# EasyEDA Pro project ProDocument_lpc-glitcherv2_2024-04-16.epro

# Schematic lpc-glitcherv2
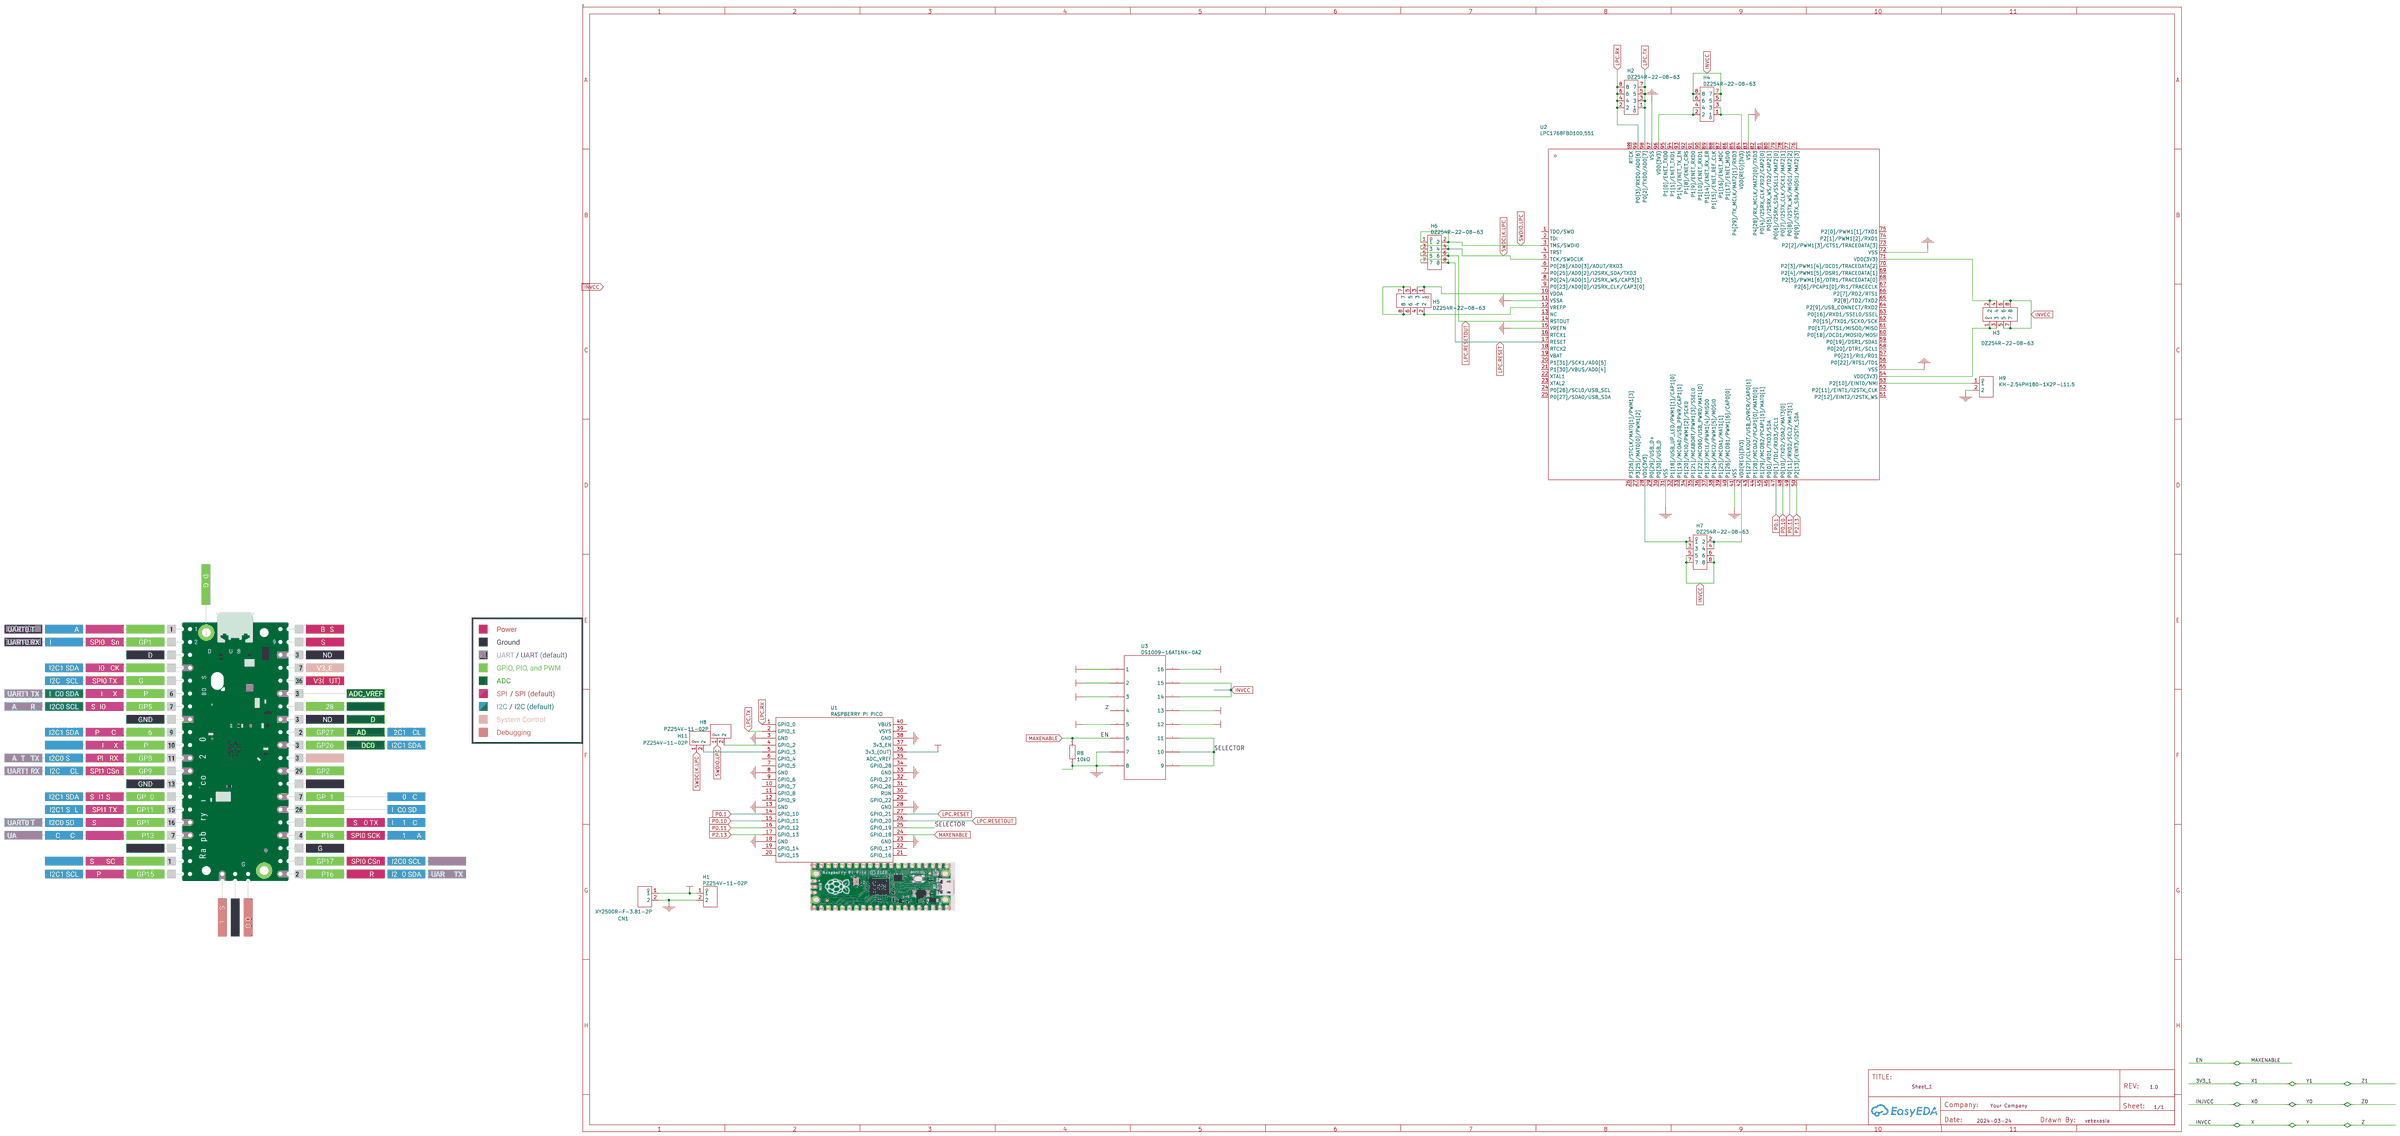
[diagram p0: schematic sheet]

## Parts
CN1  XY2500R-F-3.81-2P  [footprint_3c6d]
H1  PZ254V-11-02P  [footprint_e48f]
H2  DZ254R-22-08-63  [footprint_0830]
H3  DZ254R-22-08-63  [footprint_0830]
H4  DZ254R-22-08-63  [footprint_0830]
H5  DZ254R-22-08-63  [footprint_0830]
H6  DZ254R-22-08-63  [footprint_0830]
H7  DZ254R-22-08-63  [footprint_0830]
H8  PZ254V-11-02P  [footprint_e48f]
H9  KH-2.54PH180-1X2P-L11.5  [footprint_e48f]
H11  PZ254V-11-02P  [footprint_e48f]
R8  10kΩ  [footprint_fe1b]
U1  RASPBERRY PI PICO  [footprint_dab4]
U2  LPC1768FBD100,551  [footprint_b10c]
U3  DS1009-16AT1NX-0A2  [footprint_764f]

## Library data of the parts
CN1 = XY2500R-F-3.81-2P: Supplier: LCSC; Supplier Part: C880581; Manufacturer: XINLAIYA(新莱亚); JLCPCB Part Class: Extended Part
H1 H8 H11 = PZ254V-11-02P: Supplier: LCSC; Supplier Part: C492401; Manufacturer: XFCN(兴飞); JLCPCB Part Class: Extended Part
H2-H7 = DZ254R-22-08-63: Supplier: LCSC; Supplier Part: C2935919; Manufacturer: DEALON(德艺隆); JLCPCB Part Class: Extended Part
H9 = KH-2.54PH180-1X2P-L11.5: Supplier: LCSC; Supplier Part: C2905434; Manufacturer: kinghelm(金航标); JLCPCB Part Class: Extended Part
R8 = 10kΩ: Supplier: LCSC; Manufacturer: YAGEO(国巨); Manufacturer Part: RC0603FR-0710KL; Supplier Part: C98220; JLCPCB Part Class: Extended Part; link: https://lcsc.com/eda_search?q=C98220&amp;%26type=1&amp;ref=editor
U1 = RASPBERRY PI PICO
U2 = LPC1768FBD100,551: Supplier: LCSC; Manufacturer: NXP(恩智浦); Supplier Part: C9875; JLCPCB Part Class: Extended Part
U3 = DS1009-16AT1NX-0A2: Supplier: LCSC; Manufacturer: CONNFLY; Supplier Part: C72115; JLCPCB Part Class: Extended Part

## Nets
3V3_1: U1.36(3v3 (OUT)) U3.1 U3.3 U3.13 U3.16
GND: CN1.2 H1.2 H9.2 R8.1 U1.3(GND) U1.8(GND) U1.13(GND) U1.18(GND) U1.23(GND) U1.28(GND) U1.33(GND) U1.38(GND) U2.11(VSSA) U2.15(VREFN) U2.31(VSS) U2.41(VSS) U2.55(VSS) U2.72(VSS) U2.83(VSS) U2.97(VSS) U3.7 U3.8
EN: R8.2 U1.24(GPIO 18) U3.6
INJVCC: CN1.1 H1.1 U3.2 U3.5 U3.12
INVCC: H3.5 H3.6 H3.7 H3.8 H4.5 H4.6 H4.7 H4.8 H7.5 H7.6 H7.7 H7.8 U3.4 U3.14 U3.15
LPC.RESET: H6.7 H6.8 U1.27(GPIO 21) U2.17(RESET)
LPC.RESETOUT: H6.5 H6.6 U1.26(GPIO 20) U2.14(RSTOUT)
LPC.RX: H2.2 H2.4 H2.6 H2.8 U1.1(GPIO 0) U2.99(P0[3]/RXD0/AD0[6])
LPC.TX: H2.1 H2.3 H2.5 H2.7 U1.2(GPIO 1) U2.98(P0[2]/TXD0/AD0[7])
P0.1: U1.14(GPIO 10) U2.47(P0[1]/TD1/RXD3/SCL1)
P0.10: U1.15(GPIO 11) U2.48(P0[10]/TXD2/SDA2/MAT3[0])
P0.11: U1.16(GPIO 12) U2.49(P0[11]/RXD2/SCL2/MAT3[1])
P2.13: U1.17(GPIO 13) U2.50(P2[13]/EINT3/I2STX_SDA)
SELECTOR: U1.25(GPIO 19) U3.9 U3.10 U3.11
SWDCLK.LPC: H6.3 H6.4 H11.1 U2.5(TCK/SWDCLK)
SWDIO.LPC: H6.1 H6.2 H8.1 U2.3(TMS/SWDIO)
H3_1: H3.1 H3.3 U2.54(VDD(3V3))
H3_4: H3.2 H3.4 U2.71(VDD(3V3))
H4_1: H4.1 H4.3 U2.84(VDD(REG)(3V3))
H4_4: H4.2 H4.4 U2.96(VDD(3V3))
H5_1: H5.1 H5.3 U2.10(VDDA)
H5_4: H5.2 H5.4 U2.12(VREFP)
H7_1: H7.1 H7.3 U2.28(VDD(3V3))
H7_4: H7.2 H7.4 U2.42(VDD(REG)(3V3))
Net-(H5-5): H5.5 H5.6 H5.7 H5.8
Net-(H9-1): H9.1 U2.53(P2[10]/EINT0/NMI)
U1_4: H8.2 U1.4(GPIO 2)
U1_5: H11.2 U1.5(GPIO 3)

Not connected (* = marked no-connect by the designer): U1 6(GPIO 4) 7(GPIO 5) 9(GPIO 6) 10(GPIO 7) 11(GPIO 8) 12(GPIO 9) 19(GPIO 14) 20(GPIO 15) 21(GPIO 16) 22(GPIO 17) 29(GPIO 22) 30(RUN) 31(GPIO 26) 32(GPIO 27) 34(GPIO 28) 35(ADC_VREF) 37(3v3_EN) 39(VSYS) 40(VBUS); U2 1(TDO/SWO) 2(TDI) 4(TRST) 6(P0[26]/AD0[3]/AOUT/RXD3) 7(P0[25]/AD0[2]/I2SRX_SDA/TXD3) 8(P0[24]/AD0[1]/I2SRX_WS/CAP3[1]) 9(P0[23]/AD0[0]/I2SRX_CLK/CAP3[0]) 13(NC) 16(RTCX1) 18(RTCX2) 19(VBAT) 20(P1[31]/SCK1/AD0[5]) 21(P1[30]/VBUS/AD0[4]) 22(XTAL1) 23(XTAL2) 24(P0[28]/SCL0/USB_SCL) 25(P0[27]/SDA0/USB_SDA) 26(P3[26]/STCLK/MAT0[1]/PWM1[3]) 27(P3[25]/MAT0[0]/PWM1[2]) 29(P0[29]/USB_D+) 30(P0[30]/USB_D) 32(P1[18]/USB_UP_LED/PWM1[1]/CAP1[0]) 33(P1[19]/MCOA0/USB_PPWR/CAP1[1]) 34(P1[20]/MCI0/PWM1[2]/SCK0) 35(P1[21]/MCABORT/PWM1[3]/SSEL0) 36(P1[22]/MCOB0/USB_PWRD/MAT1[0]) 37(P1[23]/MCI1/PWM1[4]/MISO0) 38(P1[24]/MCI2/PWM1[5]/MOSI0) 39(P1[25]/MCOA1/MAT1[1]) 40(P1[26]/MCOB1/PWM1[6]/CAP0[0]) 43(P1[27]/CLKOUT/USB_OVRCR/CAP0[1]) 44(P1[28]/MCOA2/PCAP1[0]/MAT0[0]) 45(P1[29]/MCOB2/PCAP1[1]/MAT0[1]) 46(P0[0]/RD1/TXD3/SDA) 51(P2[12]/EINT2/I2STX_WS) 52(P2[11]/EINT1/I2STX_CLK) 56(P0[22]/RTS1/TD1) 57(P0[21]/RI1/RD1) 58(P0[20]/DTR1/SCL1) 59(P0[19]/DSR1/SDA1) 60(P0[18]/DCD1/MOSI0/MOSI) 61(P0[17]/CTS1/MISO0/MISO) 62(P0[15]/TXD1/SCK0/SCK) 63(P0[16]/RXD1/SSEL0/SSEL) 64(P2[9]/USB_CONNECT/RXD2) 65(P2[8]/TD2/TXD2) 66(P2[7]/RD2/RTS1) 67(P2[6]/PCAP1[0]/RI1/TRACECLK) 68(P2[5]/PWM1[6]/DTR1/TRACEDATA[0]) 69(P2[4]/PWM1[5]/DSR1/TRACEDATA[1]) 70(P2[3]/PWM1[4]/DCD1/TRACEDATA[2]) 73(P2[2]/PWM1[3]/CTS1/TRACEDATA[3]) 74(P2[1]/PWM1[2]/RXD1) 75(P2[0]/PWM1[1]/TXD1) 76(P0[9]/I2STX_SDA/MOSI1/MAT2[3]) 77(P0[8]/I2STX_WS/MISO1/MAT2[2]) 78(P0[7]/I2STX_CLK/SCK1/MAT2[1]) 79(P0[6]/I2SRX_SDA/SSEL1/MAT2[0]) 80(P0[5]/I2SRX_WS/TD2/CAP2[1]) 81(P0[4]/I2SRX_CLK/RD2/CAP2[0]) 82(P4[28]/RX_MCLK/MAT2[0]/TXD3) 85(P4[29]/TX_MCLK/MAT2[1]/RXD3) 86(P1[17]/ENET_MDIO) 87(P1[16]/ENET_MDC) 88(P1[15]/ENET_REF_CLK) 89(P1[14]/ENET_RX_ER) 90(P1[10]/ENET_RXD1) 91(P1[9]/ENET_RXD0) 92(P1[8]/ENET_CRS) 93(P1[4]/ENET_TX_EN) 94(P1[1]/ENET_TXD1) 95(P1[0]/ENET_TXD0) 100(RTCK)

# Board 1-PCB_PCB_lpc-glitcherv2_2
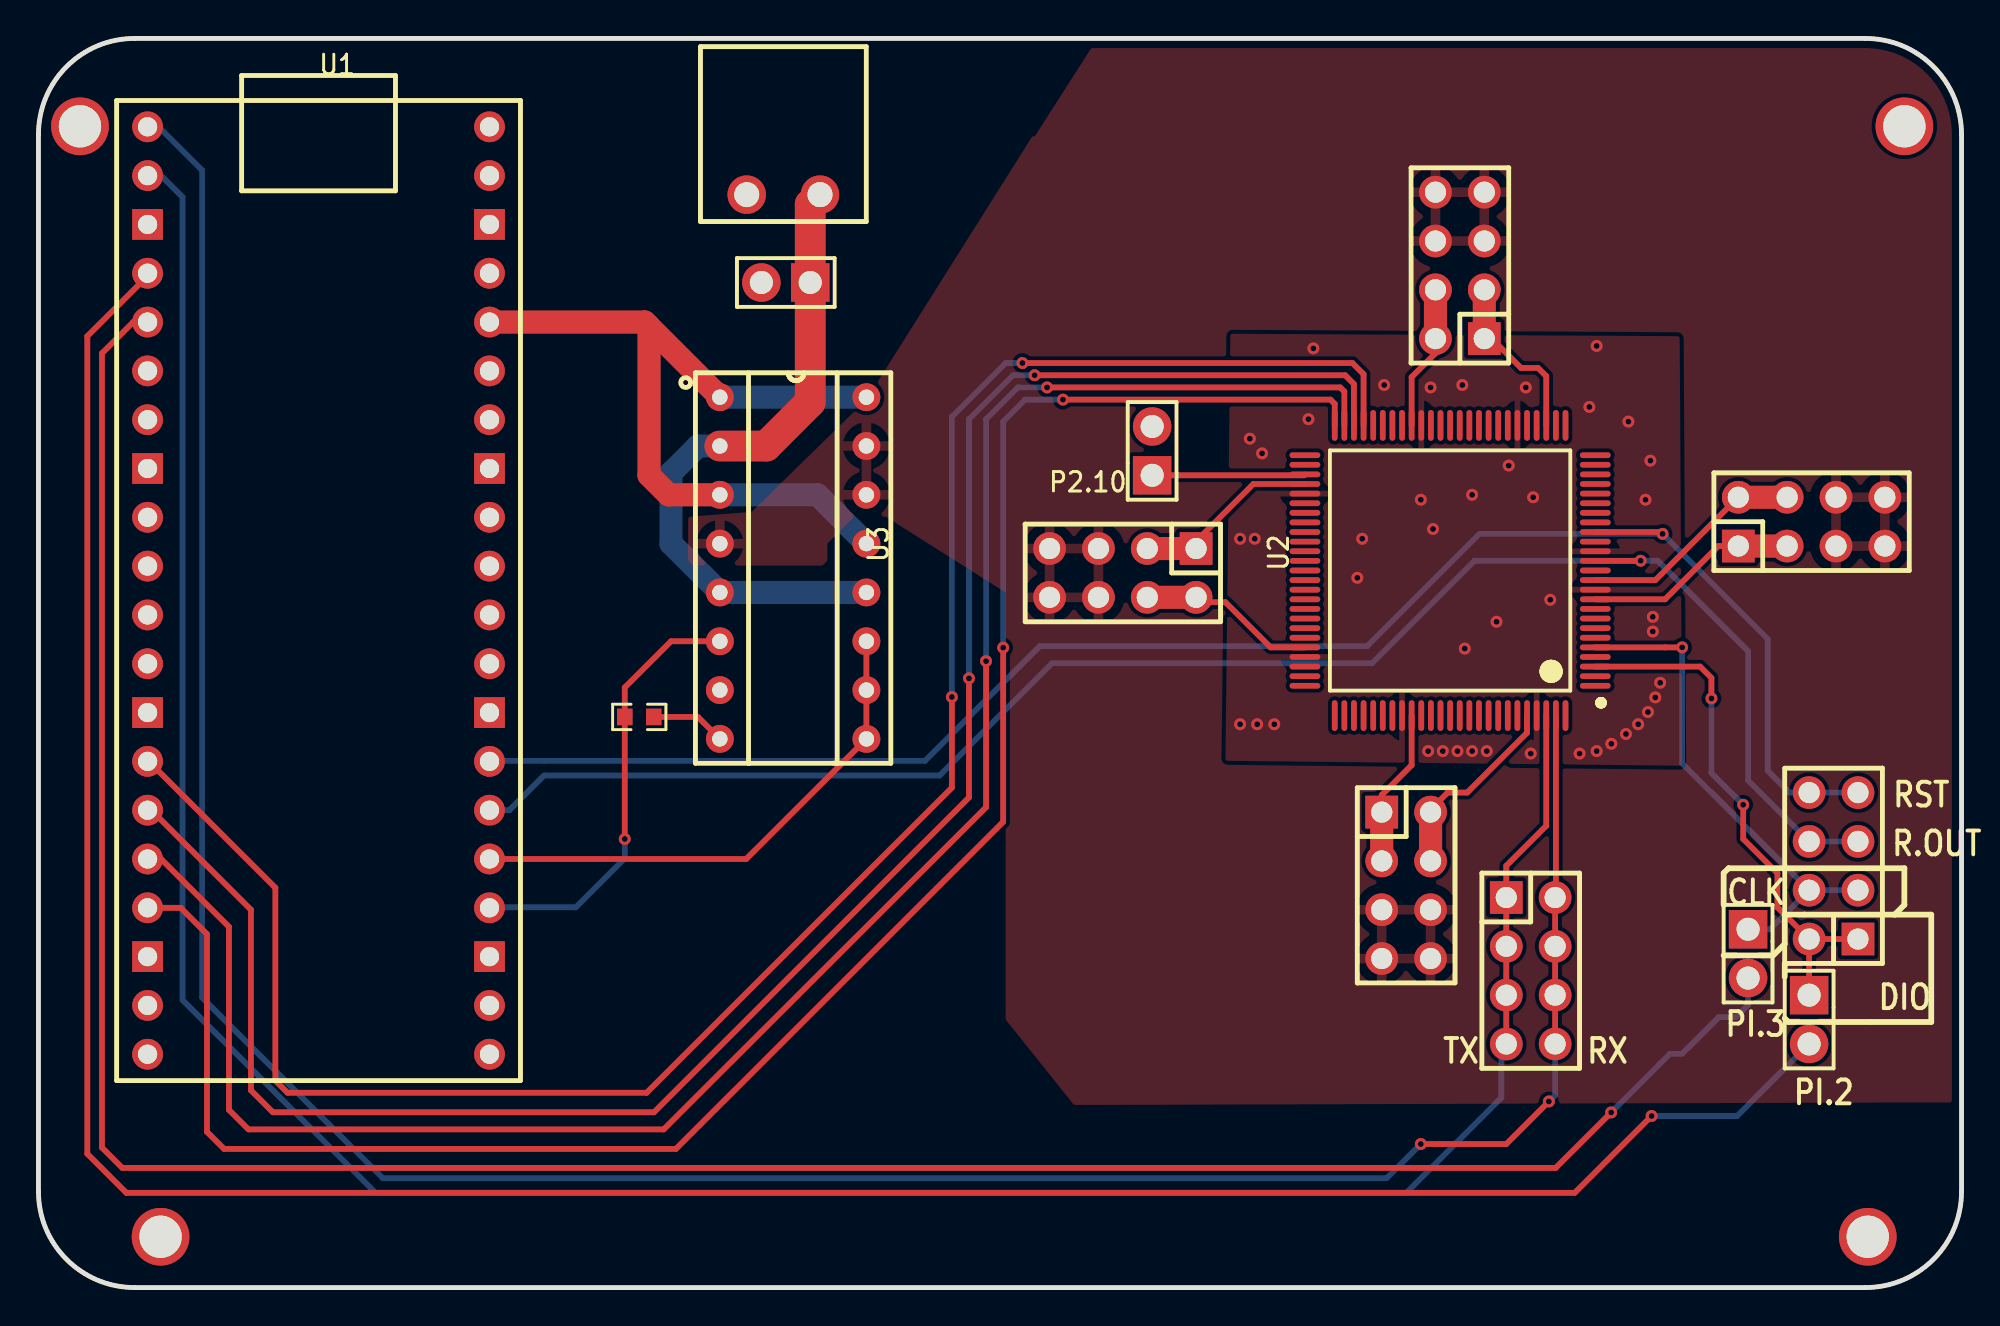
[diagram p1: board, top side]
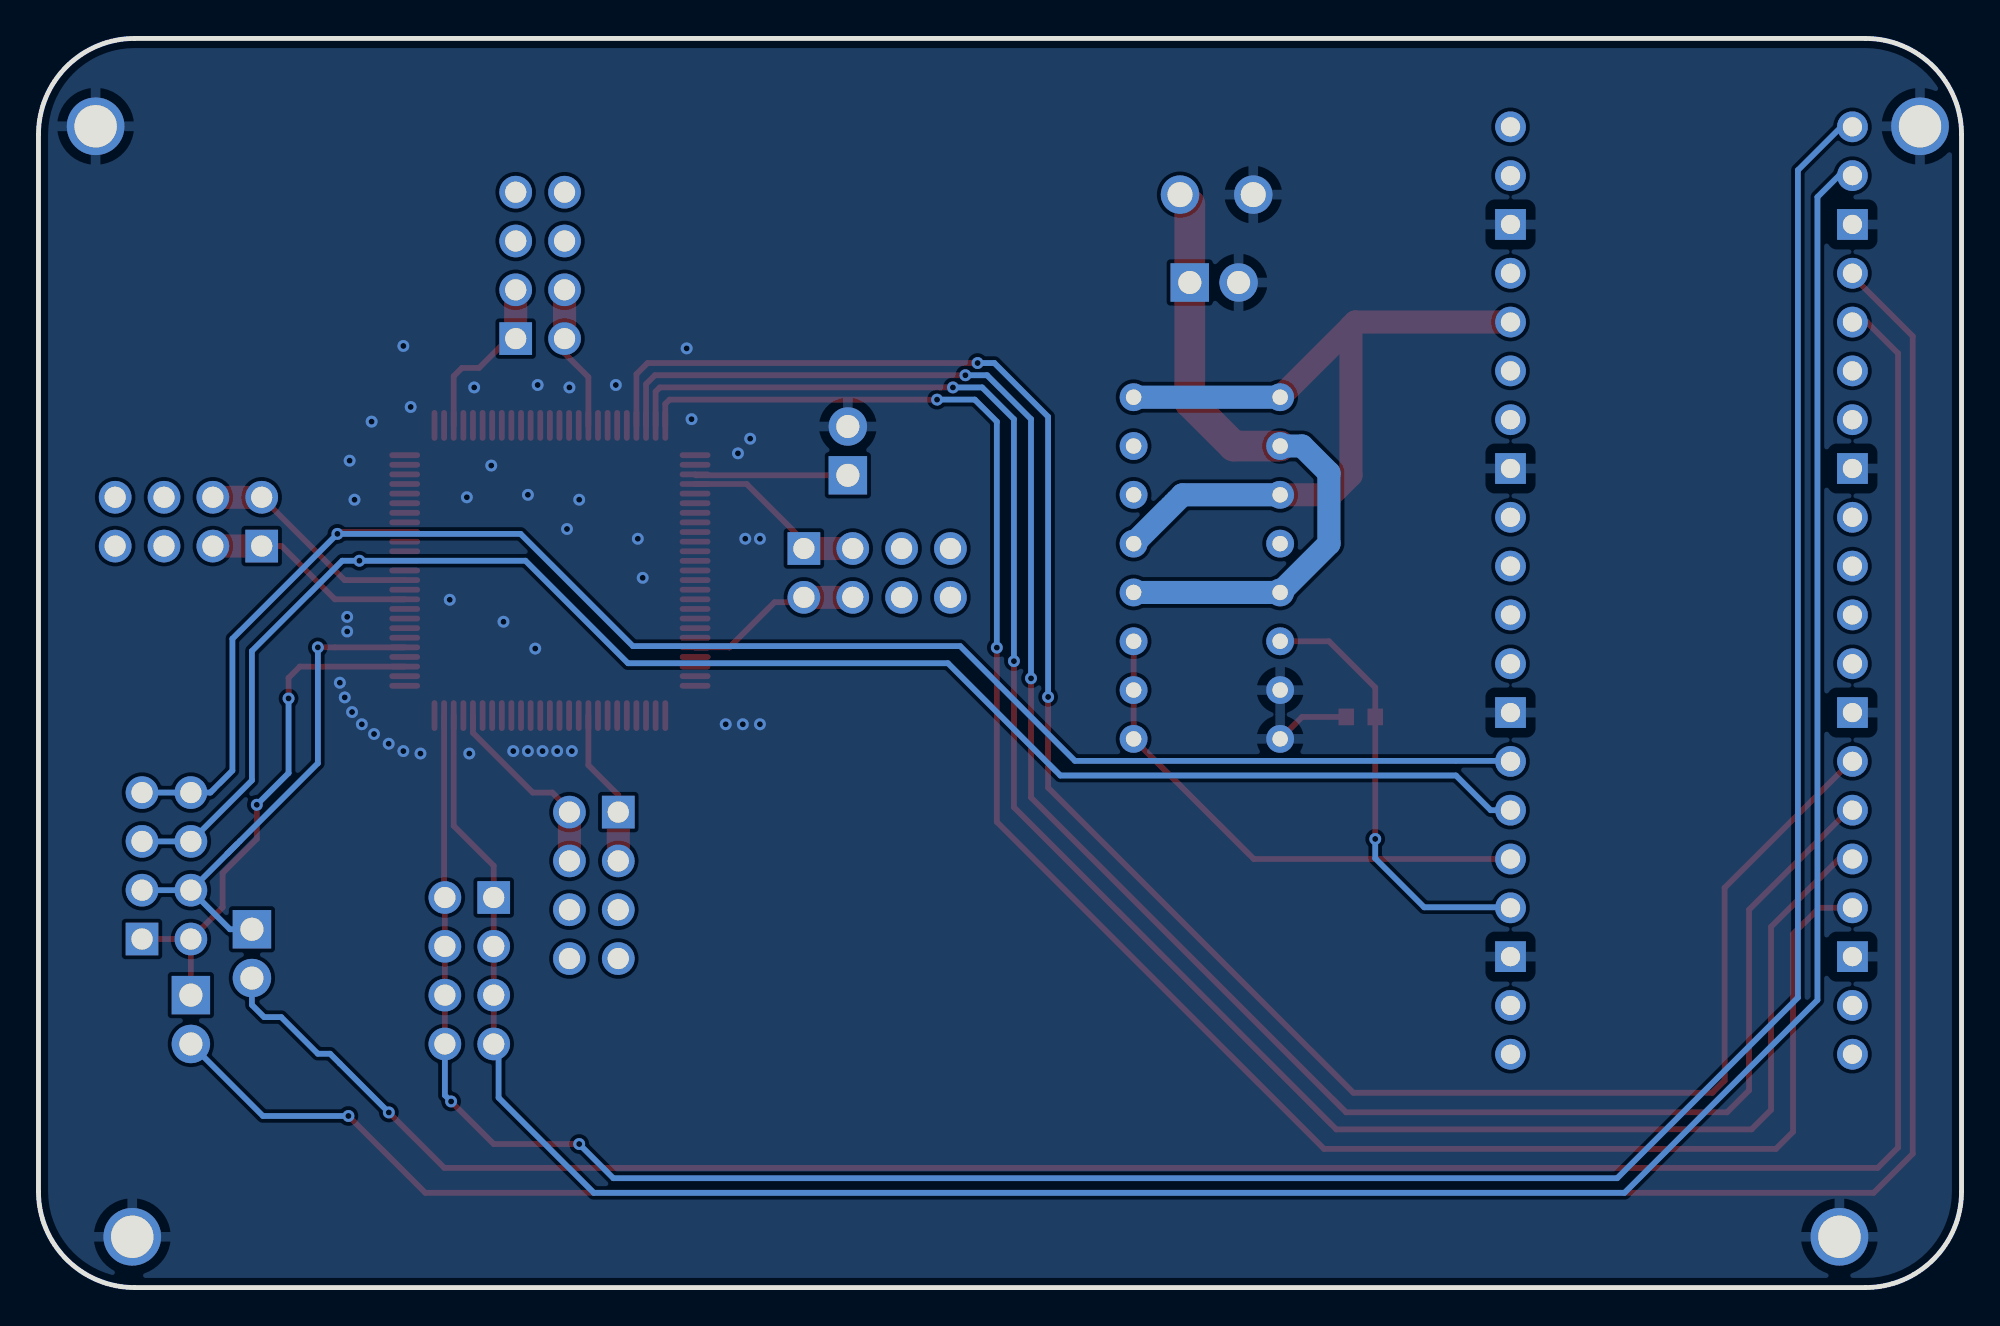
[diagram p2: board, bottom side, seen from below]

Outline 100 x 65 mm; copper layers: Top Layer, Bottom Layer. Coordinates in mm from the lower left corner of the outline.
Outline path: 0,60 arc(1.46,63.54) 5,65 95,65 arc(98.54,63.54) 100,60 100,5 arc(98.54,1.46) 95,0 5,0 arc(1.46,1.46) 0,5 0,60
Stack: Top Layer 0.035mm / Dielectric1 1.51mm FR4 er 4.5 / Bottom Layer 0.035mm

## Design rules (mm)
spacing Default (default): track to track 0.152, other pairs 0 to 0.152
track width Default (default): min 0.254, default 0.254, max 25.4
differential pair differentialPair (default): width min 0.127, default 0.254, max 2.54; gap min 0.152, default 0.152
via Default (default): diameter min 0.61, default 0.61, max 100.025; hole min 0.305, default 0.305, max 59.995
net GND uses gge7207
net Y uses gge7291
pour e84 uses gge7387
pour e224 uses gge7207
pour e225 uses gge7291

## Placement (name value [footprint] x y rotation side)
CN1  XY2500R-F-3.81-2P  [footprint_3c6d]  38.74 56.87 180 top
H1  PZ254V-11-02P  [footprint_e48f]  38.86 52.3 180 top
H2  DZ254R-22-08-63  [footprint_0830]  77.6 16.49 270 top
H3  DZ254R-22-08-63  [footprint_0830]  56.39 37.19 180 top
H4  DZ254R-22-08-63  [footprint_0830]  71.12 20.93 270 top
H5  DZ254R-22-08-63  [footprint_0830]  92.2 39.85 0 top
H6  DZ254R-22-08-63  [footprint_0830]  93.34 21.95 90 top
H7  DZ254R-22-08-63  [footprint_0830]  73.91 53.19 90 top
H8  PZ254V-11-02P  [footprint_e48f]  92.07 13.95 270 top
H11  PZ254V-11-02P  [footprint_e48f]  88.9 17.38 270 top
NOREF  -  [Pad_e504]  2.16 60.43 180 top
NOREF#2  -  [Pad_e507]  6.35 2.64 180 top
NOREF#3  -  [Pad_e506]  95.12 2.64 180 top
NOREF#4  -  [Pad_e505]  97.03 60.43 180 top
P2.10  KH-2.54PH180-1X2P-L11.5  [footprint_e48f]  57.91 43.54 90 top
R8  10kΩ  [footprint_fe1b]  31.24 29.69 180 top
U1  RASPBERRY PI PICO  [footprint_dab4]  4.06 10.77 0 top
U2  LPC1768FBD100,551  [footprint_b10c]  73.41 37.31 90 top
U3  DS1009-16AT1NX-0A2  [footprint_764f]  39.24 37.44 270 top

## Footprints (pads in the part's own frame, mm; a bottom-side part is the same pattern mirrored in y, then rotated)
footprint_3c6d
  round 2 hole 1.3: 1(-1.905,0) 2(1.905,0)
footprint_764f
  round 1.45 hole 0.8: 1(-8.89,-3.81) 2(-6.35,-3.81) 3(-3.81,-3.81) 4(-1.27,-3.81) 5(1.27,-3.81) 6(3.81,-3.81) 7(6.35,-3.81) 8(8.89,-3.81) 9(8.89,3.81) 10(6.35,3.81) 11(3.81,3.81) 12(1.27,3.81) 13(-1.27,3.81) 14(-3.81,3.81) 15(-6.35,3.81) 16(-8.89,3.81)
footprint_0830
  rect 1.7x1.7 hole 1.1: 1(-3.81,-1.27)
  round 1.7 hole 1.1: 2(-3.81,1.27) 3(-1.27,-1.27) 4(-1.27,1.27) 5(1.27,-1.27) 6(1.27,1.27) 7(3.81,-1.27) 8(3.81,1.27)
footprint_b10c
  oval 0.3x1.6 smd: 1(-6,-7.55) 2(-5.5,-7.55) 3(-5,-7.55) 4(-4.5,-7.55) 5(-4,-7.55) 6(-3.5,-7.55) 7(-3,-7.55) 8(-2.5,-7.55) 9(-2,-7.55) 10(-1.5,-7.55) 11(-1,-7.55) 12(-0.5,-7.55) 13(0,-7.55) 14(0.5,-7.55) 15(1,-7.55) 16(1.5,-7.55) 17(2,-7.55) 18(2.5,-7.55) 19(3,-7.55) 20(3.5,-7.55) 21(4,-7.55) 22(4.5,-7.55) 23(5,-7.55) 24(5.5,-7.55) 25(6,-7.55) 51(6,7.55) 52(5.5,7.55) 53(5,7.55) 54(4.5,7.55) 55(4,7.55) 56(3.5,7.55) 57(3,7.55) 58(2.5,7.55) 59(2,7.55) 60(1.5,7.55) 61(1,7.55) 62(0.5,7.55) 63(0,7.55) 64(-0.5,7.55) 65(-1,7.55) 66(-1.5,7.55) 67(-2,7.55) 68(-2.5,7.55) 69(-3,7.55) 70(-3.5,7.55) 71(-4,7.55) 72(-4.5,7.55) 73(-5,7.55) 74(-5.5,7.55) 75(-6,7.55)
  oval 1.6x0.3 smd: 26(7.55,-6) 27(7.55,-5.5) 28(7.55,-5) 29(7.55,-4.5) 30(7.55,-4) 31(7.55,-3.5) 32(7.55,-3) 33(7.55,-2.5) 34(7.55,-2) 35(7.55,-1.5) 36(7.55,-1) 37(7.55,-0.5) 38(7.55,0) 39(7.55,0.5) 40(7.55,1) 41(7.55,1.5) 42(7.55,2) 43(7.55,2.5) 44(7.55,3) 45(7.55,3.5) 46(7.55,4) 47(7.55,4.5) 48(7.55,5) 49(7.55,5.5) 50(7.55,6) 76(-7.55,6) 77(-7.55,5.5) 78(-7.55,5) 79(-7.55,4.5) 80(-7.55,4) 81(-7.55,3.5) 82(-7.55,3) 83(-7.55,2.5) 84(-7.55,2) 85(-7.55,1.5) 86(-7.55,1) 87(-7.55,0.5) 88(-7.55,0) 89(-7.55,-0.5) 90(-7.55,-1) 91(-7.55,-1.5) 92(-7.55,-2) 93(-7.55,-2.5) 94(-7.55,-3) 95(-7.55,-3.5) 96(-7.55,-4) 97(-7.55,-4.5) 98(-7.55,-5) 99(-7.55,-5.5) 100(-7.55,-6)
footprint_dab4
  round 1.6 hole 1: 1(1.61,49.63) 2(1.61,47.09) 4(1.61,42.01) 5(1.61,39.47) 6(1.61,36.93) 7(1.61,34.39) 9(1.61,29.31) 10(1.61,26.77) 11(1.61,24.23) 12(1.61,21.69) 14(1.61,16.61) 15(1.61,14.07) 16(1.61,11.53) 17(1.61,8.99) 19(1.61,3.91) 20(1.61,1.37) 21(19.39,1.37) 22(19.39,3.91) 24(19.39,8.99) 25(19.39,11.53) 26(19.39,14.07) 27(19.39,16.61) 29(19.39,21.69) 30(19.39,24.23) 31(19.39,26.77) 32(19.39,29.31) 34(19.39,34.39) 35(19.39,36.93) 36(19.39,39.47) 37(19.39,42.01) 39(19.39,47.09) 40(19.39,49.63)
  rect 1.6x1.6 hole 1: 3(1.61,44.55) 8(1.61,31.85) 13(1.61,19.15) 18(1.61,6.45) 23(19.39,6.45) 28(19.39,19.15) 33(19.39,31.85) 38(19.39,44.55)
footprint_e48f
  rect 2x2 hole 1.2: 1(-1.27,0)
  round 2 hole 1.2: 2(1.27,0)
footprint_fe1b
  rect 0.806x0.864 smd: 1(-0.753,0) 2(0.753,0)
Pad_e504
  round 3 hole 2.2: 1(0,0)
Pad_e505
  round 3 hole 2.2: 1(0,0)
Pad_e506
  round 3 hole 2.2: 1(0,0)
Pad_e507
  round 3 hole 2.2: 1(0,0)

## Nets
As in the schematic, except:
GND: CN1.2 H1.2 NOREF.1 NOREF#2.1 NOREF#3.1 NOREF#4.1 P2.10.2 R8.1 U1.3 U1.8 U1.13 U1.18 U1.23 U1.28 U1.33 U1.38 U2.11 U2.15 U2.31 U2.41 U2.55 U2.72 U2.83 U2.97 U3.7 U3.8
H9_1: P2.10.1 U2.53
Y: H3.5 H3.6 H3.7 H3.8 H4.5 H4.6 H4.7 H4.8 H5.5 H5.6 H5.7 H5.8 H7.5 H7.6 H7.7 H7.8 U3.4 U3.14 U3.15

## Via types
v1: diameter 0.62, hole 0.31, Top Layer to Bottom Layer, 62 vias

## Routing (per net, layer and track width the routed paths; a pad name or vN(x,y) marks a point on that pad's centre or on a via; arc(x,y) is an arc through that point)
3V3_1: length 42.1
  Top Layer w1.2: 31.52,50.24 U3.1 ; 31.52,50.24 U1.36 ; 31.52,50.24 31.75,50.01 31.75,42.27 32.77,41.25 U3.3
  Bottom Layer w1.2: U3.3 40.51,41.25 U3.13 ; U3.16 U3.1
GND: length 3.9
  Top Layer w0.3: R8.1 34.29,29.69 U3.8
  vias: v1(62.48,38.97) v1(62.48,29.31) v1(62.99,44.17) v1(63.25,38.97) v1(63.37,29.31) v1(63.63,43.41) v1(64.26,29.31) v1(66.04,45.19) v1(66.29,48.87) v1(68.58,36.93) v1(68.83,38.97) v1(69.98,46.97) v1(71.88,41) v1(72.26,27.92) v1(72.39,46.84) v1(72.52,39.47) v1(73.03,27.92) v1(73.79,27.92) v1(74.04,46.97) v1(74.17,33.25) v1(74.55,41.25) v1(74.55,27.92) v1(75.31,27.92) v1(75.82,34.65) v1(76.45,42.78) v1(77.34,46.84) v1(77.6,27.79) v1(77.72,41.12) v1(78.61,35.79) v1(80.14,27.79) v1(80.65,45.82) v1(81.03,49) v1(81.03,27.92) v1(81.79,28.3) v1(82.55,28.81) v1(82.68,45.06) v1(83.19,29.31) v1(83.57,41) v1(83.69,29.95) v1(83.82,43.03) v1(83.95,34.9) v1(83.95,34.14) v1(84.07,30.71) v1(84.33,31.47)
EN: length 22.9
  Top Layer w0.3: v1(30.49,23.34) R8.2 30.49,31.23 32.89,33.63 U3.6
  Bottom Layer w0.3: v1(30.49,23.34) 30.49,22.34 27.94,19.79 23.48,19.79 U1.24
H3_1: length 9.8
  Top Layer w0.3: H3.1 60.2,38.84 63.17,41.81 U2.54
  Top Layer w1.2: H3.3 H3.1
H3_4: length 9.3
  Top Layer w0.3: U2.71 64.07,33.31 61.72,35.66 60.45,35.66 H3.2
  Top Layer w1.2: H3.2 H3.4
H4_1: length 8.2
  Top Layer w0.3: H4.1 69.85,25.63 71.41,27.19 U2.84
  Top Layer w1.2: H4.1 H4.3
H4_4: length 10.2
  Top Layer w0.3: U2.96 77.41,28.87 74.29,25.76 73.28,25.76 72.39,24.87 H4.2
  Top Layer w1.2: H4.2 H4.4
H5_1: length 11.1
  Top Layer w0.3: U2.10 84.58,35.81 87.35,38.58 H5.1
  Top Layer w1.2: H5.3 H5.1
H5_4: length 11.8
  Top Layer w0.3: U2.12 84.08,36.81 H5.2
  Top Layer w1.2: H5.4 H5.2
H7_1: length 9.1
  Top Layer w0.3: U2.28 78.41,47.43 77.98,47.86 77.09,47.86 75.56,49.38 75.18,49.38
  Top Layer w1.2: H7.3 75.18,49.38
H7_4: length 7.6
  Top Layer w0.3: U2.42 71.41,47.38 72.64,48.62 72.64,49.38
  Top Layer w1.2: H7.4 72.64,49.38
H9_1: length 8
  Top Layer w0.3: P2.10.1 65.81,42.27 U2.53
INJVCC: length 34.7
  Top Layer w1.6: CN1.1 40.13,56.36 H1.1 40.13,46.08 37.85,43.79 U3.2
  Bottom Layer w1.2: U3.2 34.29,43.79 32.89,42.39 32.89,38.71 U3.5 U3.12
LPC.RESET: length 89.3
  Top Layer w0.3: 80.96,39.31 84.46,39.31 v1(84.46,39.22)
  Bottom Layer w0.3: H6.7 H6.8 91.06,25.76 89.92,26.9 89.92,33.76 v1(84.46,39.22) 74.93,39.22 69.09,33.38 52.07,33.38 46.1,27.41 23.48,27.41 U1.27
LPC.RESETOUT: length 88.9
  Top Layer w0.3: v1(83.31,37.82) 83.31,37.81 U2.14
  Bottom Layer w0.3: H6.5 H6.6 88.9,26.39 88.9,33.12 84.2,37.82 v1(83.31,37.82) 74.68,37.82 69.34,32.49 52.71,32.49 46.86,26.65 26.29,26.65 24.48,24.84 23.45,24.84
LPC.RX: length 142.6
  Top Layer w0.3: v1(71.88,7.47) 76.33,7.47 v1(78.54,9.68) ; U2.99 78.91,20.33 H2.2 H2.4 H2.6 H2.8
  Bottom Layer w0.3: v1(78.54,9.68) 78.87,10.01 H2.8 ; v1(71.88,7.47) 70.1,5.69 17.91,5.69 8.51,15.09 8.51,58.14 6.25,60.4 5.67,60.4
LPC.TX: length 139.7
  Top Layer w0.3: H2.7 H2.5 H2.3 H2.1 76.33,21.95 78.41,24.03 U2.98
  Bottom Layer w0.3: H2.7 76.07,12.42 76.07,9.88 71.12,4.93 17.53,4.93 7.49,14.96 7.49,56.75 6.38,57.86 U1.2
P0.1: length 106.2
  Top Layer w0.3: 68.91,44.86 68.91,47.53 68.33,48.11 v1(51.17,48.11) ; U1.14 5.74,27.38 12.32,20.8 12.32,10.77 12.95,10.14 31.62,10.14 47.5,26.01 v1(47.5,30.73)
  Bottom Layer w0.3: v1(47.5,30.73) 47.5,45.31 50.29,48.11 v1(51.17,48.11)
P0.10: length 104.5
  Top Layer w0.3: 5.67,24.84 5.87,24.84 11.05,19.66 11.05,10.26 12.19,9.12 32,9.12 48.39,25.5 v1(48.39,31.7) ; v1(51.8,47.47) 67.94,47.47 68.4,47.01 68.4,44.86
  Bottom Layer w0.3: 48.39,31.7 48.39,45.19 50.67,47.47 v1(51.8,47.47)
P0.11: length 103.3
  Top Layer w0.3: v1(52.45,46.84) 67.69,46.84 67.91,46.62 67.91,44.86 ; U1.16 6.38,22.3 9.91,18.77 9.91,9.25 10.92,8.23 32.51,8.23 49.28,25 v1(49.28,32.6)
  Bottom Layer w0.3: v1(49.28,32.6) 49.28,45.19 50.93,46.84 v1(52.45,46.84)
P2.13: length 102.5
  Top Layer w0.3: U2.50 67.41,45.98 67.18,46.2 v1(53.27,46.2) ; v1(50.16,33.3) 50.16,24.23 33.15,7.22 9.65,7.22 8.76,8.1 8.76,18.39 7.39,19.76 U1.17
  Bottom Layer w0.3: v1(53.27,46.2) 51.31,46.2 50.16,45.06 v1(50.16,33.3)
SELECTOR: length 27.3
  Top Layer w0.3: U1.25 36.8,22.3 U3.9 U3.11
SWDCLK.LPC: length 27.2
  Top Layer w0.3: v1(85.47,33.31) U2.5
  Bottom Layer w0.3: H6.3 H6.4 ; H6.4 90.04,18.64 H11.1 ; H6.4 90.17,22.58 ; 89.66,23.09 90.17,22.58 ; 90.17,22.58 85.47,27.28 v1(85.47,33.31)
SWDIO.LPC: length 27.4
  Top Layer w0.3: v1(88.65,25.12) 88.65,23.34 90.42,21.57 90.42,19.79 H6.2 ; H6.1 H6.2 ; H6.2 H8.1 ; v1(87,30.66) 87,31.73 86.41,32.31 80.96,32.31
  Bottom Layer w0.3: v1(87,30.66) 87,26.77 v1(88.65,25.12)
U1_4: length 140.7
  Top Layer w0.3: v1(83.88,8.93) 79.88,4.93 4.57,4.93 2.54,6.96 2.54,49.51 5.67,52.64 U1.4
  Bottom Layer w0.3: v1(83.88,8.93) 88.33,8.93 H8.2
U1_5: length 135.3
  Top Layer w0.3: U1.5 4.93,50.24 3.3,48.62 3.3,7.28 4.36,6.23 78.9,6.23 v1(81.78,9.11)
  Bottom Layer w0.3: v1(81.78,9.11) 84.84,12.17 85.47,12.17 87.38,14.07 88.26,14.07 88.9,14.71 H11.2

## Copper pours and planes (outline as drawn; the poured copper is in the pictures)
GND on Top Layer: 61.98,49.63 85.34,49.51 85.47,28.17 85.47,27.15 61.72,27.41
GND on Bottom Layer: -6.73,68.56 -6.73,-44.85 -7.75,-45.87 125.73,-45.87 126.37,-46.51 126.37,69.7 124.71,71.35
Y on Top Layer: 33.78,40.11 33.78,37.82 34.04,37.57 40.77,37.57 41.02,37.82 41.02,38.71 42.42,40.11 44.07,40.11 50.29,36.17 50.29,13.95 53.85,9.5 96.01,9.63 103.5,9.63 101.47,13.69 102.74,62.46 96.65,65.89 55.88,66.27 51.82,59.92 51.69,59.92 43.05,46.2 37.08,40.36

## Text on the board
Top Silkscreen Layer: TX | RX | PI.3 | CLK | PI.2 | DIO | R.OUT | RST
